# EAGLE design Crazebird-v0.8 (EAGLE 6.6.0)
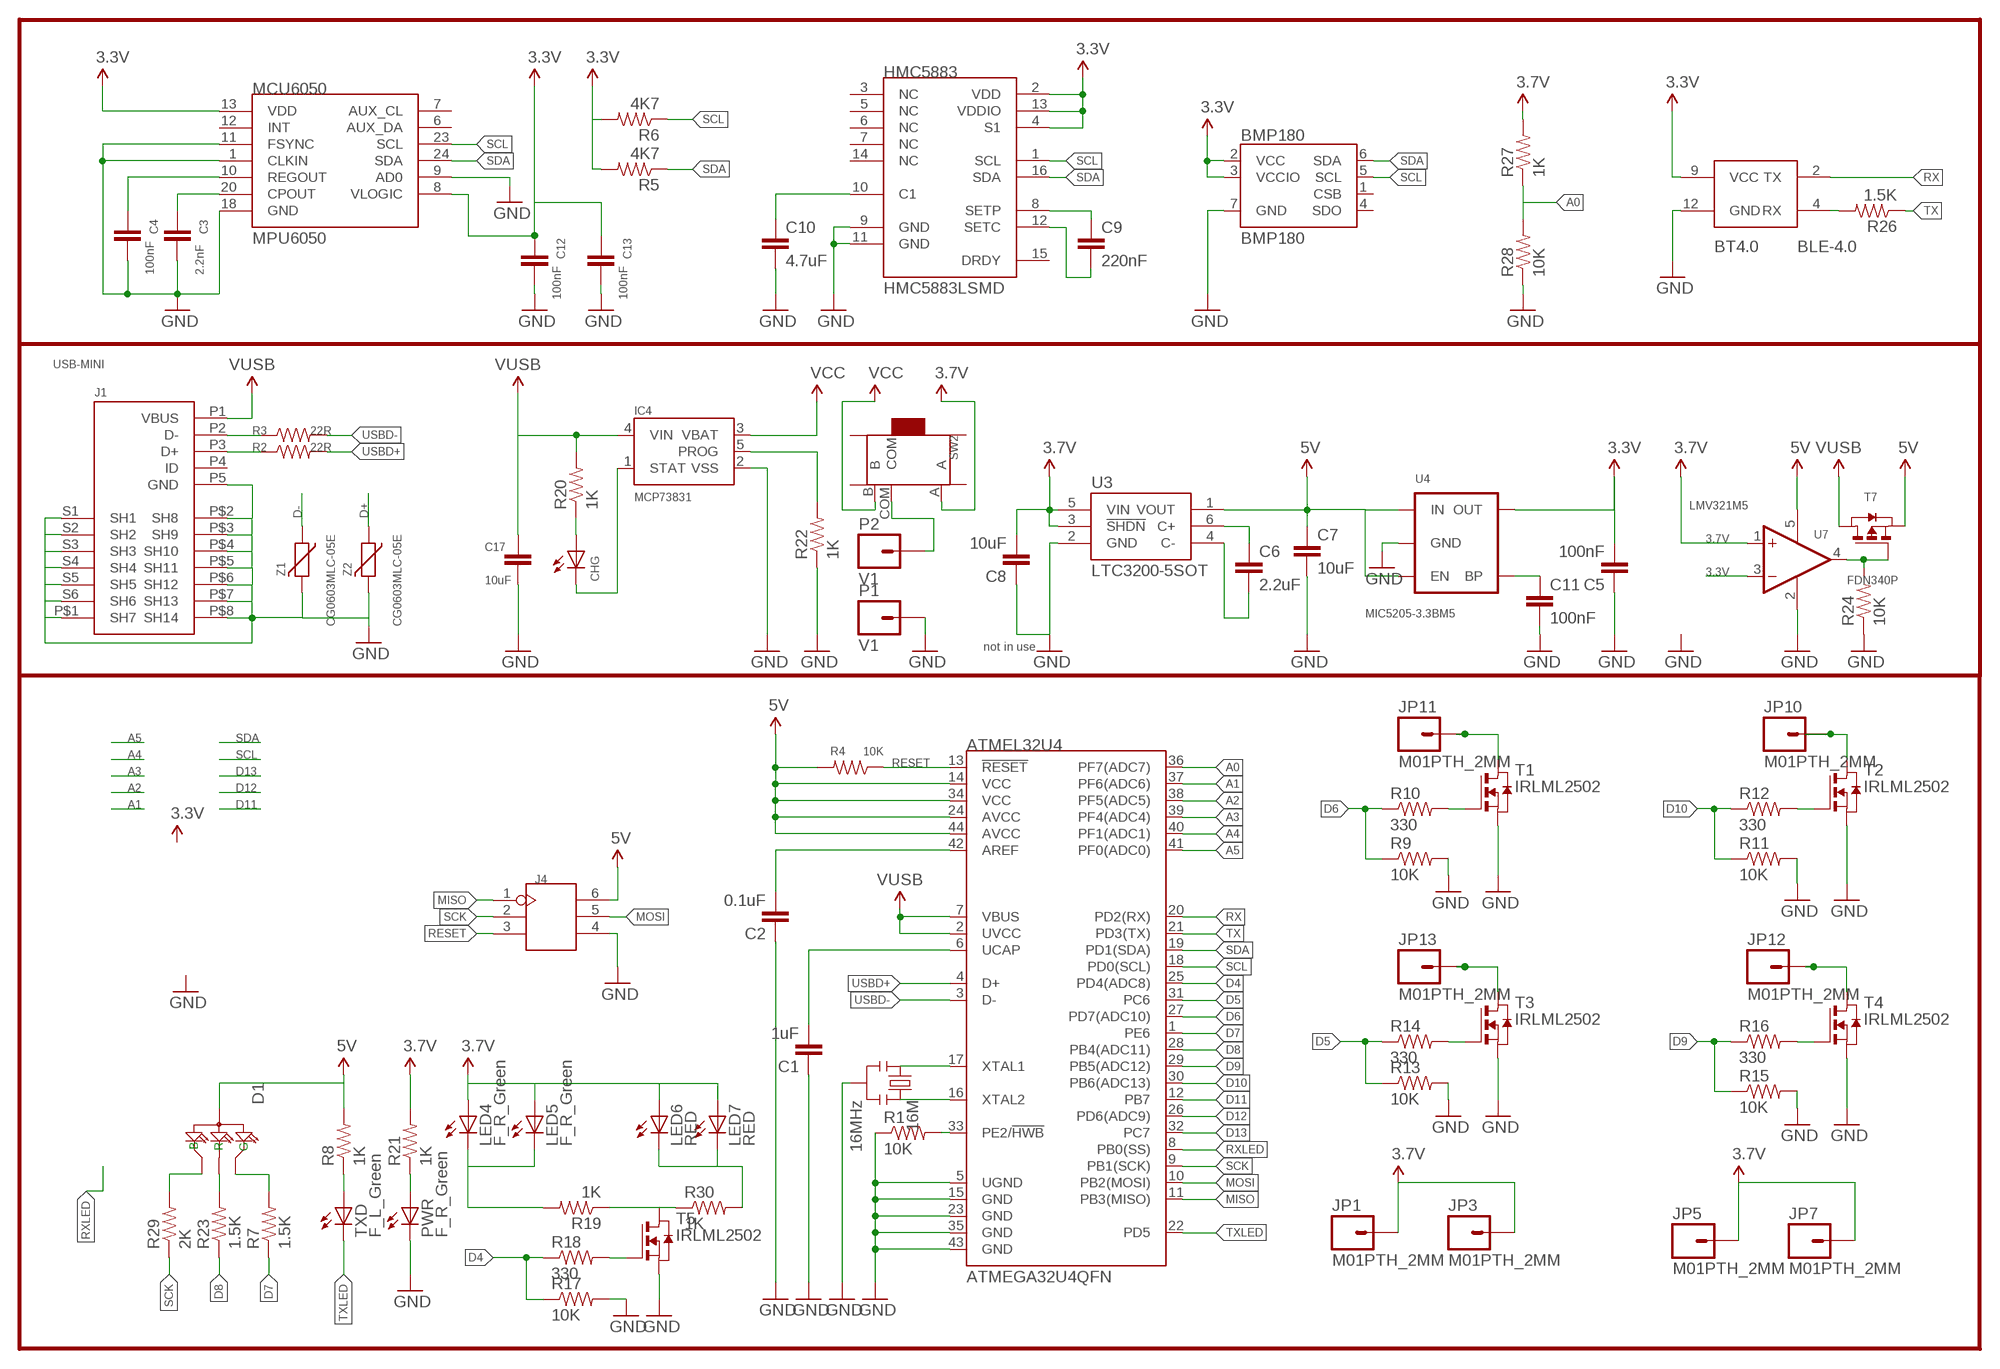
[diagram p0: schematic, sheet 1]

## Parts
16M  16MHz  RESONATOR16MHZ  [RESONATOR-SMD]
ATMEL32U4  ATMEGA32U4QFN  [SPARKFUN-DIGITALIC_QFN-44]
BMP180  BMP180  [BMP180]
BT4.0  BLE-4.0  HEXAIRBOT-HEXNANO_BLUETOOTH_HM11  [HEXAIRBOT-HEXNANO_BLUETOOTH_HM11]
C1  1uF  CAP0402-CAP  [0402-CAP]
C2  0.1uF  CAP0402-CAP  [0402-CAP]
C3  2.2nF  CAP0402-CAP  [0402-CAP]
C4  100nF  CAP0402-CAP  [0402-CAP]
C5  100nF  CAP0402-CAP  [0402-CAP]
C6  2.2uF  CAP0402-CAP  [0402-CAP]
C7  10uF  CAP0402-CAP  [0402-CAP]
C8  10uF  CAP0805  [0805]
C9  220nF  CAP0402-CAP  [0402-CAP]
C10  4.7uF  CAP0402-CAP  [0402-CAP]
C11  100nF  CAP0402-CAP  [0402-CAP]
C12  100nF  CAP0402-CAP  [0402-CAP]
C13  100nF  CAP0402-CAP  [0402-CAP]
C17  10uF  CAP0805  [0805]
CHG  Yellow  LEDCHIPLED_0603  [CHIPLED_0603]
D1  LED-ARGB-4P-1206  [LED-4P-1206-3.0X1.5]
HMC5883  HMC5883LSMD  [16LPCC]
IC4  MCP73831  [SOT23-5]
J1  USB-MINI  [USB_MICRO]
J4  CONNECTOR_HEADER-2X3P-2.0  [CONNECTOR_2X3P-2.0]
JP1  M01PTH_2MM  [1X01_2MM]
JP3  M01PTH_2MM  [1X01_2MM]
JP5  M01PTH_2MM  [1X01_2MM]
JP7  M01PTH_2MM  [1X01_2MM]
JP10  M01PTH_2MM  [1X01_2MM]
JP11  M01PTH_2MM  [1X01_2MM]
JP12  M01PTH_2MM  [1X01_2MM]
JP13  M01PTH_2MM  [1X01_2MM]
LED4  F_R_Green  LEDCHIPLED_0603  [CHIPLED_0603]
LED5  F_R_Green  LEDCHIPLED_0603  [CHIPLED_0603]
LED6  RED  LEDCHIPLED_0603  [CHIPLED_0603]
LED7  RED  LEDCHIPLED_0603  [CHIPLED_0603]
MCU6050  MPU6050  TESTING_MPU-6050-1  [TESTING_QFN-24-4MM2]
P1  V1  M01PTH  [1X01]
P2  V1  M01PTH  [1X01]
PWR  F_R_Green  LEDCHIPLED_0603  [CHIPLED_0603]
R1  10K  RESISTOR0402-RES  [0402-RES]
R2  22R  RESISTOR0402-RES  [0402-RES]
R3  22R  RESISTOR0402-RES  [0402-RES]
R4  10K  RESISTOR0402-RES  [0402-RES]
R5  4K7  RESISTOR0402-RES  [0402-RES]
R6  4K7  RESISTOR0402-RES  [0402-RES]
R7  1.5K  RESISTOR0402-RES  [0402-RES]
R8  1K  RESISTOR0402-RES  [0402-RES]
R9  10K  RESISTOR0402-RES  [0402-RES]
R10  330  RESISTOR0402-RES  [0402-RES]
R11  10K  RESISTOR0402-RES  [0402-RES]
R12  330  RESISTOR0402-RES  [0402-RES]
R13  10K  RESISTOR0402-RES  [0402-RES]
R14  330  RESISTOR0402-RES  [0402-RES]
R15  10K  RESISTOR0402-RES  [0402-RES]
R16  330  RESISTOR0402-RES  [0402-RES]
R17  10K  RESISTOR0402-RES  [0402-RES]
R18  330  RESISTOR0402-RES  [0402-RES]
R19  1K  RESISTOR0402-RES  [0402-RES]
R20  1K  RESISTOR0402-RES  [0402-RES]
R21  1K  RESISTOR0402-RES  [0402-RES]
R22  1K  RESISTOR0402-RES  [0402-RES]
R23  1.5K  RESISTOR0402-RES  [0402-RES]
R24  10K  RESISTOR0402-RES  [0402-RES]
R26  1.5K  RESISTOR0402-RES  [0402-RES]
R27  1K  RESISTOR0402-RES  [0402-RES]
R28  10K  RESISTOR0402-RES  [0402-RES]
R29  2K  RESISTOR0402-RES  [0402-RES]
R30  1K  RESISTOR0402-RES  [0402-RES]
SW2  SWITCH-3P-SMD-6.6X2.8  [3P-SMD-2CH-6.6X2.8-REINFORCE]
T1  IRLML2502  NMOSSOT23  [SOT-23]
T2  IRLML2502  NMOSSOT23  [SOT-23]
T3  IRLML2502  NMOSSOT23  [SOT-23]
T4  IRLML2502  NMOSSOT23  [SOT-23]
T5  IRLML2502  NMOSSOT23  [SOT-23]
T7  FDN340P  [SOT23]
TXD  F_L_Green  LEDCHIPLED_0603  [CHIPLED_0603]
U3  LTC3200-5SOT  [SOT23-6]
U4  MIC5205-3.3BM5  MIC52053.3V  [SOT23-5]
U7  LMV321M5  [SOT23-5]
Z1  CG0603MLC-05E  VARISTORCN0603  [CT/CN0603]
Z2  CG0603MLC-05E  VARISTORCN0603  [CT/CN0603]

## Nets
3.3V: BMP180.2(VCC) BMP180.3(VCCIO) BT4.0.9(VCC) C5.2 C12.1 C13.1 HMC5883.2(VDD) HMC5883.4(S1) HMC5883.13(VDDIO) MCU6050.8(VLOGIC) MCU6050.13(VDD) R5.2 R6.2 U4.5(OUT) U7.3(-IN)
3.7V: C8.2 JP1.1 JP3.1 JP5.1 JP7.1 LED4.A LED5.A LED6.A LED7.A R21.2 R27.2 SW2.A U3.3(!SHDN) U3.5(VIN) U7.1(+IN)
5V: ATMEL32U4.14(VCC) ATMEL32U4.24(AVCC) ATMEL32U4.34(VCC) ATMEL32U4.44(AVCC) C7.1 D1.2(+) J4.6 R4.2 R8.2 T7.2(S) U3.1(VOUT) U4.1(IN) U4.3(EN) U7.5(V+)
A0: ATMEL32U4.36(PF7(ADC7)) R27.1 R28.2
A1: ATMEL32U4.37(PF6(ADC6))
A2: ATMEL32U4.38(PF5(ADC5))
A3: ATMEL32U4.39(PF4(ADC4))
A4: ATMEL32U4.40(PF1(ADC1))
A5: ATMEL32U4.41(PF0(ADC0))
D4: ATMEL32U4.25(PD4(ADC8)) R17.1 R18.1
D5: ATMEL32U4.31(PC6) R13.1 R14.1
D6: ATMEL32U4.27(PD7(ADC10)) R9.1 R10.1
D7: ATMEL32U4.1(PE6) R7.1
D8: ATMEL32U4.28(PB4(ADC11)) R23.1
D9: ATMEL32U4.29(PB5(ADC12)) R15.1 R16.1
D10: ATMEL32U4.30(PB6(ADC13)) R11.1 R12.1
D11: ATMEL32U4.12(PB7)
D12: ATMEL32U4.26(PD6(ADC9))
D13: ATMEL32U4.32(PC7)
D+: J1.P3(D+) R2.1 Z2.1
D-: J1.P2(D-) R3.1 Z1.1
GND [gnd]: 16M.2 ATMEL32U4.5(UGND) ATMEL32U4.15(GND) ATMEL32U4.23(GND) ATMEL32U4.35(GND) ATMEL32U4.43(GND) BMP180.7(GND) BT4.0.12(GND) C1.1 C2.1 C3.2 C4.2 C5.1 C7.2 C8.1 C10.2 C11.2 C12.2 C13.2 C17.1 HMC5883.9(GND) HMC5883.11(GND) IC4.2(VSS) J1.P5(GND) J1.P$1(SH7) J1.P$2(SH8) J1.P$3(SH9) J1.P$4(SH10) J1.P$5(SH11) J1.P$6(SH12) J1.P$7(SH13) J1.P$8(SH14) J1.S1(SH1) J1.S2(SH2) J1.S3(SH3) J1.S4(SH4) J1.S5(SH5) J1.S6(SH6) J4.4 MCU6050.1(CLKIN) MCU6050.9(AD0) MCU6050.11(FSYNC) MCU6050.18(GND) P1.1 PWR.C R1.1 R9.2 R11.2 R13.2 R15.2 R17.2 R22.1 R24.1 R28.1 T1.2(S) T2.2(S) T3.2(S) T4.2(S) T5.2(S) U3.2(GND) U4.2(GND) U7.2(V-) Z1.2 Z2.2
MISO: ATMEL32U4.11(PB3(MISO)) J4.1
MOSI: ATMEL32U4.10(PB2(MOSI)) J4.5
N$1: 16M.1 ATMEL32U4.17(XTAL1)
N$2: 16M.3 ATMEL32U4.16(XTAL2)
N$3: CHG.C IC4.1(STAT)
N$4: CHG.A R20.1
N$5: ATMEL32U4.6(UCAP) C1.2
N$6: ATMEL32U4.42(AREF) C2.2
N$7: R8.1 TXD.A
N$8: C4.1 MCU6050.10(REGOUT)
N$9: C3.1 MCU6050.20(CPOUT)
N$10: D1.1(B) R29.2
N$11: ATMEL32U4.33(PE2/!HWB) R1.2
N$12: R18.2 T5.3(G)
N$13: PWR.A R21.1
N$14: R12.2 T2.3(G)
N$15: R10.2 T1.3(G)
N$16: JP11.1 T1.1(D)
N$17: JP10.1 T2.1(D)
N$18: R14.2 T3.3(G)
N$19: JP13.1 T3.1(D)
N$20: R16.2 T4.3(G)
N$21: JP12.1 T4.1(D)
N$22: R19.1 R30.1 T5.1(D)
N$23: C9.1 HMC5883.8(SETP)
N$24: LED4.C LED5.C R19.2
N$25: C6.1 U3.6(C+)
N$26: IC4.5(PROG) R22.2
N$27: C6.2 U3.4(C-)
N$28: C9.2 HMC5883.12(SETC)
N$29: C10.1 HMC5883.10(C1)
N$30: P2.1 SW2.COM
N$31: C11.1 U4.4(BP)
N$32: D1.4(R) R23.2
N$33: D1.3(G) R7.2
N$34: R24.2 T7.3(G) U7.4(OUT)
N$35: BT4.0.4(RX) R26.2
N$36: LED6.C LED7.C R30.2
RESET: ATMEL32U4.13(!RESET) J4.3 R4.1
RX: ATMEL32U4.20(PD2(RX)) BT4.0.2(TX)
RXLED: ATMEL32U4.8(PB0(SS))
SCK: ATMEL32U4.9(PB1(SCK)) J4.2 R29.1
SCL: ATMEL32U4.18(PD0(SCL)) BMP180.5(SCL) HMC5883.1(SCL) MCU6050.23(SCL) R6.1
SDA: ATMEL32U4.19(PD1(SDA)) BMP180.6(SDA) HMC5883.16(SDA) MCU6050.24(SDA) R5.1
TX: ATMEL32U4.21(PD3(TX)) R26.1
TXLED: ATMEL32U4.22(PD5) TXD.C
USBD+: ATMEL32U4.4(D+) R2.2
USBD-: ATMEL32U4.3(D-) R3.2
VCC: IC4.3(VBAT) SW2.B
VUSB: ATMEL32U4.2(UVCC) ATMEL32U4.7(VBUS) C17.2 IC4.4(VIN) J1.P1(VBUS) R20.2 T7.1(D)
Unconnected: BMP180.1(CSB) BMP180.4(SDO) HMC5883.3(NC) HMC5883.5(NC) HMC5883.6(NC) HMC5883.7(NC) HMC5883.14(NC) HMC5883.15(DRDY) J1.P4(ID) MCU6050.6(AUX_DA) MCU6050.7(AUX_CL) MCU6050.12(INT) SW2.SS1 SW2.SS2 SW2.SS3 SW2.SS4

## Notes on the sheet
- not in use

## Library data of the parts
16M = SparkFun-FreqCtrl:RESONATOR: Resonator Small SMD resonator. Used, eg, on the Arduino Pro/ Pro Mini boards. 8MHz- XTAL-08895 16MHz- XTAL-08900; PROD_ID: XTAL-08900
ATMEL32U4 = SparkFun-DigitalIC:ATMEGA32U4: Atmel 44-pin 8-bit Microcontroller with 32KBytes of ISP Flash and USB Controller ----- Please use the QFN-44-NOPAD_1:1 package for the footprint of all boards using a 32U4. Route traces directly away from the pads as much as possible.
BMP180 = duinofun-ic:BMP180: BMP085 Pressure Sensor Great little MEMS pressure sensor. SKU: COM-09603
BT4.0 = MainBoard:HEXAIRBOT-HEXNANO_BLUETOOTH_HM11: BLE 4.0 Module
C1-C13 = SparkFun-Passives:CAP: Capacitor Standard 0603 ceramic capacitor, and 0.1" leaded capacitor.
C17 = SparkFun:CAP: Capacitor Standard 0603 ceramic capacitor, and 0.1" leaded capacitor.
CHG LED4-LED7 PWR TXD = led:LED: LED OSRAM: - CHIPLED LG R971, LG N971, LY N971, LG Q971, LY Q971, LO R971, LY R971 LH N974, LH R974 LS Q976, LO Q976, LY Q976 LO Q996 - Hyper CHIPLED LW Q18S LB Q993, LB Q99A, LB R99A - SideLED LS A670, LO A670, LY A670, LG A670, LP A670 LB A673, LV A673, LT A673, LW A673 LH A674 LY A675 LS A676, LA A676, LO A676, LY A676, LW A676 LS A679, LY A679, LG A679 - Hyper Micro SIDELED® LS Y876, LA Y876, LO Y876, LY Y876 LT Y87S - SmartLED LW L88C, LW L88S LB L89C, LB L89S, LG L890 LS L89K, LO L89K, LY L89K LS L896, LA L896, LO L896, LY L896 - TOPLED LS T670, LO T670, LY T670, LG T670, LP T670 LSG T670, LSP T670, LSY T670, LOP T670, LYG T670 LG T671, LOG T671, LSG T671 LB T673, LV T673, LT T673, LW T673 LH T674 LS T676, LA T676, LO T676, LY T676, LB T676, LH T676, LSB T676, LW T676 LB T67C, LV T67C, LT T67C, LS T67K, LO T67K, LY T67K, LW E67C LS E67B, LA E67B, LO E67B, LY E67B, LB E67C, LV E67C, LT E67C LW T67C LS T679, LY T679, LG T679 LS T770, LO T770, LY T770, LG T770, LP T770 LB T773, LV T773, LT T773, LW T773 LH T774 LS E675, LA E675, LY E675, LS T675 LS T776, LA T776, LO T776, LY T776, LB T776 LHGB T686 LT T68C, LB T68C - Hyper Mini TOPLED® LB M676 - Mini TOPLED Santana® LG M470 LS M47K, LO M47K, LY M47K Source: http://www.osram.convergy.de LUXEON: - LUMILED® LXK2-PW12-R00, LXK2-PW12-S00, LXK2-PW14-U00, LXK2-PW14-V00 LXK2-PM12-R00, LXK2-PM12-S00, LXK2-PM14-U00 LXK2-PE12-Q00, LXK2-PE12-R00, LXK2-PE12-S00, LXK2-PE14-T00, LXK2-PE14-U00 LXK2-PB12-K00, LXK2-PB12-L00, LXK2-PB12-M00, LXK2-PB14-N00, LXK2-PB14-P00, LXK2-PB14-Q00 LXK2-PR12-L00, LXK2-PR12-M00, LXK2-PR14-Q00, LXK2-PR14-R00 LXK2-PD12-Q00, LXK2-PD12-R00, LXK2-PD12-S00 LXK2-PH12-R00, LXK2-PH12-S00 LXK2-PL12-P00, LXK2-PL12-Q00, LXK2-PL12-R00 Source: www.luxeon.com KINGBRIGHT: KA-3528ASYC Source: www.kingbright.com
D1 = duinofun-main:LED-ARGB*-4P
HMC5883 = HexAirbot-HexNano:HMC5883L: 3 Axis Digital Compass IC
IC4 = SparkFun:MCP73831: Microchip's MCP73831 Miniature single cell, fully integrated Li-Ion, Li-polymer charge management controller http://ww1.microchip.com/downloads/en/DeviceDoc/21984a.pdf
J1 = QXZ:USB-MINI
J4 = duinofun-connector:CONNECTOR_HEADER-2X3P
JP1 JP3 JP5 JP7 JP10-JP13 = duinofun-connector:M01: Header 1 Standard 1-pin 0.1" header. Use with straight break away headers (SKU : PRT-00116), right angle break away headers (PRT-00553), swiss pins (PRT-00743), machine pins (PRT-00117), and female headers (PRT-00115).
MCU6050 = MPU6050:TESTING_MPU-6050
P1 P2 = SparkFun-Connectors:M01: Header 1 Standard 1-pin 0.1" header. Use with straight break away headers (SKU : PRT-00116), right angle break away headers (PRT-00553), swiss pins (PRT-00743), machine pins (PRT-00117), and female headers (PRT-00115).
R1-R24 R26-R30 = SparkFun-Passives:RESISTOR: Resistor Basic schematic elements and footprints for 0603, 1206, and PTH resistors.
SW2 = duinofun-ic:SWITCH-3P-SMD
T1-T5 = zetex:NMOSSOT23: MOS FET; OC_FARNELL: unknown; OC_NEWARK: unknown
T7 = HexAirbot-HexNano:FDN340P: MOS FET
U3 = HexAirbot-HexNano:LTC3200-5: Linear Technology. Low Noise, Regulated Charge Pump DC/DC Converters, SOT23-6. Fixed 5V ± 4% Output or ADJ VIN Range: 2.7V to 4.5V
U4 = SparkFun-PowerIC:MIC5205: MIC5205 150mA vreg 3.3V - VREG-00822 5V - VREG-00823; PROD_ID: VREG-00822
U7 = linear:LMV321?*: General Purpose, Low Voltage, Rail-to-Rail Output Operational Amplifiers Source: http://www.national.com/mpf/LM/LMV321.html http://www.national.com/dt/lmv_qual.pdf
Z1 Z2 = varistor:VARISTOR: VARISTOR

## Net classes
0 default: width 0.254 mm, drill 0.61 mm, clearance 0.254 mm
2 gnd: width 0.254 mm, drill 0.61 mm, clearance 0.254 mm

## Board
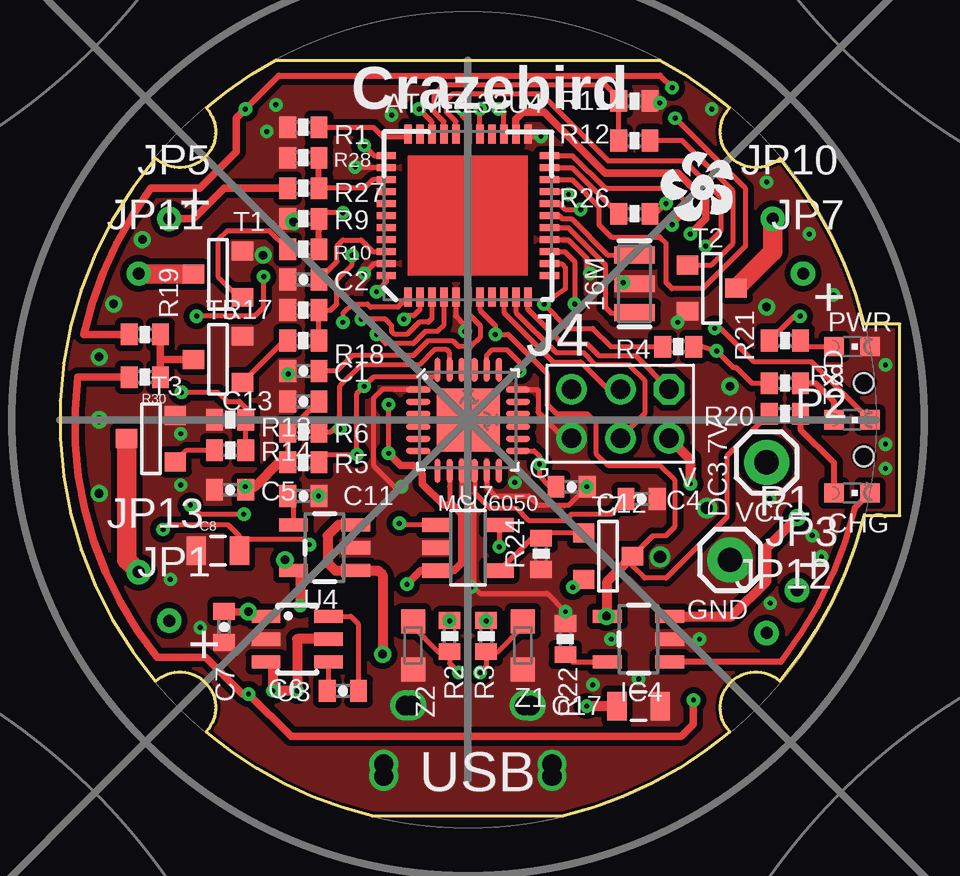
[diagram p1: board, top side]
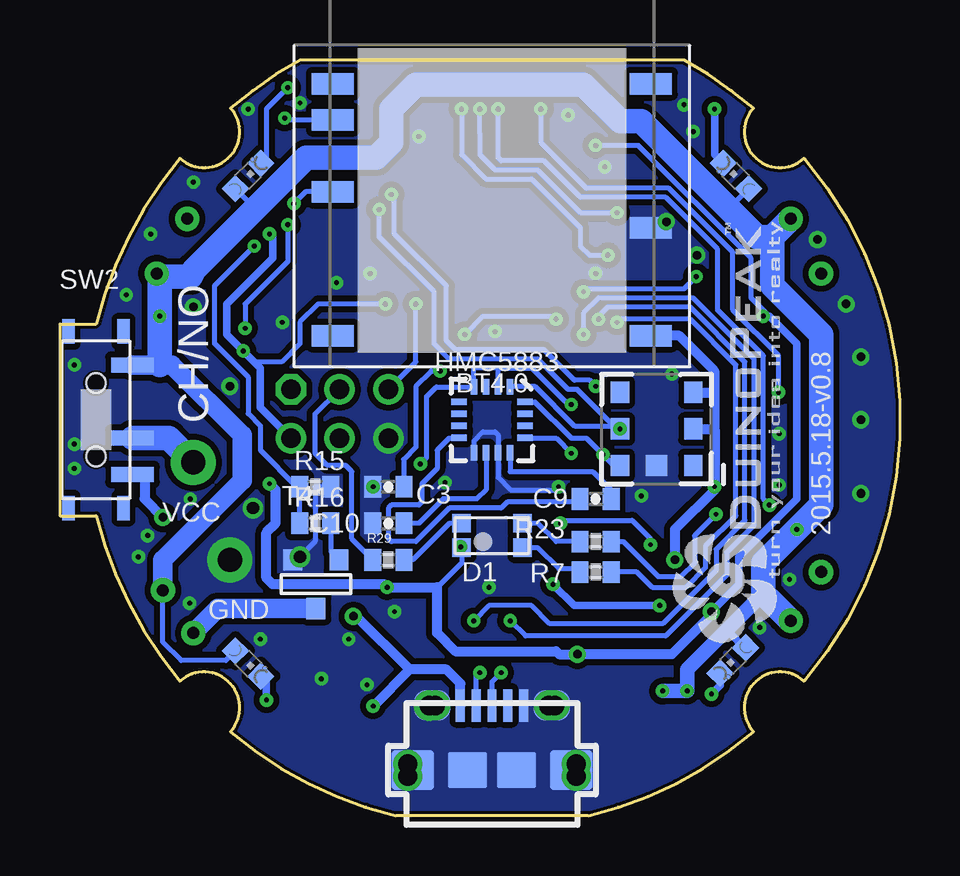
[diagram p2: board, bottom side, seen from below]

Size 35 x 31.5 mm. Coordinates in mm from the lower left corner, seen from the top.
Copper layers (1*16): Top 0.035mm / dielectric 1.5mm / Bottom 0.035mm
Design rules "Sparkfun *": minimum track width 10mil, minimum drill 10mil, track to track 5mil, track to pad 5mil, pad to pad 8mil, via to via 8mil, smd to smd 8mil, copper to edge 5mil, drill to drill 5mil, minimum pad ring 7mil, minimum via ring 7mil, stop-mask expansion 1mil, vias tented up to drill 25mil, thermal gap 2mil

### Footprints (pad centres in the part's own frame; a part is rotated, then mirrored left to right if it is on the bottom)
RESONATOR-SMD = smd 0.7 x 1.7: 1 -1.2,0; 2 0,0; 3 1.2,0
SPARKFUN-DIGITALIC_QFN-44 = smd 0.8 x 0.3: 1 -3.4,2.5; 2 -3.4,2; 3 -3.4,1.5; 4 -3.4,1; 5 -3.4,0.5; 6 -3.4,0; 7 -3.4,-0.5; 8 -3.4,-1; 9 -3.4,-1.5; 10 -3.4,-2; 11 -3.4,-2.5; 23 3.4,-2.5; 24 3.4,-2; 25 3.4,-1.5; 26 3.4,-1; 27 3.4,-0.5; 28 3.4,0; 29 3.4,0.5; 30 3.4,1; 31 3.4,1.5; 32 3.4,2; 33 3.4,2.5 | smd 0.3 x 0.8: 12 -2.5,-3.4; 13 -2,-3.4; 14 -1.5,-3.4; 15 -1,-3.4; 16 -0.5,-3.4; 17 0,-3.4; 18 0.5,-3.4; 19 1,-3.4; 20 1.5,-3.4; 21 2,-3.4; 22 2.5,-3.4; 34 2.5,3.4; 35 2,3.4; 36 1.5,3.4; 37 1,3.4; 38 0.5,3.4; 39 0,3.4; 40 -0.5,3.4; 41 -1,3.4; 42 -1.5,3.4; 43 -2,3.4; 44 -2.5,3.4
BMP180 = smd 0.762 x 0.889: 1 0,0; 2 0,-1.524; 3 0,-3.048; 4 3.048,-3.048; 5 3.048,-1.524; 6 3.048,0 | smd 0.889 x 0.889: 7 1.524,0
HEXAIRBOT-HEXNANO_BLUETOOTH_HM11 = smd 1.75 x 0.9: 1 -6.625,4.859; 2 -6.625,3.359; 4 -6.625,0.359; 8 -6.625,-5.641; 9 6.625,-5.641; 12 6.625,-1.141; 16 6.625,4.859
0402-CAP = smd 0.7 x 0.9: 1 -0.65,0; 2 0.65,0
0805 = smd 0.8 x 1.2: 1 -0.9,0; 2 0.9,0
CHIPLED_0603 = smd 0.8 x 0.8: A 0,-0.75; C 0,0.75
LED-4P-1206-3.0X1.5 = smd 0.762 x 0.762: 1 -1.27,0.508; 2 -1.27,-0.508; 3 1.27,-0.508; 4 1.27,0.508
16LPCC = smd 0.65 x 0.28: 1 -1.37,0.75; 2 -1.37,0.25; 3 -1.37,-0.25; 4 -1.37,-0.75; 9 1.37,-0.75; 10 1.37,-0.25; 11 1.37,0.25; 12 1.37,0.75 | smd 0.28 x 0.65: 5 -0.75,-1.37; 6 -0.25,-1.37; 7 0.25,-1.37; 8 0.75,-1.37; 13 0.75,1.37; 14 0.25,1.37; 15 -0.25,1.37; 16 -0.75,1.37
SOT23-5 = smd 0.55 x 1.2: 1 -0.95,-1.3; 2 0,-1.3; 3 0.95,-1.3; 4 0.95,1.3; 5 -0.95,1.3
USB_MICRO = smd 0.406 x 1.346: P1 -1.321,2.692; P2 -0.66,2.692; P3 0,2.692; P4 0.66,2.692; P5 1.321,2.692 | drill 0.8 pad 1.27: P$1 -2.616,2.692 | drill 0.8 pad 1.245: P$2 -2.362,2.692; P$7 2.362,2.692; P$8 2.616,2.692 | drill 0.8 pad 1.143: P$3 -3.505,-0.254; P$4 -3.505,0.254; P$5 3.505,0.254; P$6 3.505,-0.254 | smd 1.778 x 1.651: S1 -3.302,0; S2 3.302,0 | smd 1.524 x 1.27: S3 -2.489,2.692; S4 2.489,2.692 | smd 1.626 x 1.524: S5 -1.016,0; S6 1.016,0
CONNECTOR_2X3P-2.0 = drill 0.813 pad 1.27 octagon: 1 -1.016,2.032 | drill 0.813 pad 1.27: 2 -1.016,0; 3 -1.016,-2.032; 4 1.016,-2.032; 5 1.016,0; 6 1.016,2.032
1X01_2MM = drill 0.508 pad 1.016: 1 0,0
TESTING_QFN-24-4MM2 = smd 1.016 x 0.254: 1 -2.066,1.257; 2 -2.066,0.75; 3 -2.066,0.247; 4 -2.066,-0.287; 5 -2.066,-0.792; 6 -2.066,-1.297; 13 2.086,-1.297; 14 2.086,-0.792; 15 2.086,-0.287; 16 2.086,0.247; 17 2.086,0.75; 18 2.086,1.257 | smd 0.254 x 1.016: 7 -1.267,-2.122; 8 -0.762,-2.122; 9 -0.258,-2.122; 10 0.278,-2.122; 11 0.78,-2.122; 12 1.287,-2.122; 19 1.287,2.082; 20 0.78,2.082; 21 0.278,2.082; 22 -0.258,2.082; 23 -0.762,2.082; 24 -1.267,2.082 | smd 2.616 x 2.616: P$1 0.02,-0.01
1X01 = drill 1.016 pad 1.88: 1 0,0
0402-RES = smd 0.7 x 0.9: 1 -0.65,0; 2 0.65,0
3P-SMD-2CH-6.6X2.8-REINFORCE = smd 1.778 x 0.635: A 1.524,2.286; B 1.524,-2.286; COM 1.524,-0.762 | smd 0.508 x 1.016: SS1 -1.143,-3.683; SS2 1.143,-3.683; SS3 1.143,3.683; SS4 -1.143,3.683 | hole 0.813: 0,-1.524; 0,1.524
SOT-23 = smd 0.787 x 0.889: 1 0.025,-1.016; 2 -0.94,1.016; 3 0.991,1.016
SOT23 = smd 0.787 x 0.889: 1 0.025,-1.016; 2 -0.94,1.016; 3 0.991,1.016
SOT23-6 = smd 0.55 x 1.2: 1 -0.95,-1.3; 2 0,-1.3; 3 0.95,-1.3; 4 0.95,1.3; 5 0,1.3; 6 -0.95,1.3
SOT23-5' = smd 0.6 x 1.2: 1 -0.95,-1.306; 2 0,-1.306; 3 0.95,-1.306; 4 0.95,1.306; 5 -0.95,1.306
CT/CN0603 = smd 1 x 1: 1 -1,0; 2 1,0

### Placement (x,y rotation side)
16M  23.93,22.17 270 top
ATMEL32U4  17,25.01 90 top
BMP180  8.61,14.6 180 bottom
BT4.0  17,25.64 0 bottom
C1  10.14,18.53 0 top
C2  10.14,22.34 0 top
C3  21.31,13.71 180 bottom
C4  24.23,13.2 0 top
C5  7.09,13.58 0 top
C6  11.79,5.2 180 top
C7  6.84,7.86 270 top
C8  6.58,11.04 0 top
C9  12.68,13.2 0 bottom
C10  21.31,12.18 180 bottom
C11  10.14,13.32 0 top
C12  21.31,13.71 0 top
C13  10.14,17.26 180 top
C17  24.11,4.56 180 top
CHG  33,13.45 270 top
D1  17,11.67 0 bottom
HMC5883  17,16.5 270 bottom
IC4  24.11,7.36 90 top
J1  17,1.89 0 bottom
J4  23.35,16.75 270 top
JP1  4.55,8.12 0 top
JP3  30.71,9.39 0 top
JP5  4.55,24.88 0 top
JP7  30.97,22.6 0 top
JP10  29.7,24.88 0 top
JP11  3.28,22.6 0 top
JP12  29.44,7.61 0 top
JP13  3.28,10.15 0 top
LED4  6.84,26.66 45 bottom
LED5  27.16,26.66 315 bottom
LED6  27.16,6.34 225 bottom
LED7  6.96,6.47 135 bottom
MCU6050  17,16.5 0 top
P1  27.92,10.66 0 top
P2  29.44,14.72 0 top
PWR  33,19.55 270 top
R1  10.14,28.69 0 top
R2  16.23,7.48 90 top
R3  17.76,7.48 90 top
R4  25.76,19.55 0 top
R5  10.14,14.72 180 top
R6  10.14,15.99 180 top
R7  12.68,10.15 180 bottom
R8  30.2,18.02 180 top
R9  10.14,24.88 180 top
R10  10.14,23.61 180 top
R11  23.93,29.79 0 top
R12  23.93,28.14 0 top
R13  7.09,16.5 180 top
R14  7.09,15.23 180 top
R15  24.36,13.71 0 bottom
R16  24.36,12.18 0 bottom
R17  10.14,21.07 180 top
R18  10.14,19.8 180 top
R19  3.53,20.06 180 top
R20  30.2,16.75 180 top
R21  30.2,19.8 180 top
R22  21.06,7.36 270 top
R23  12.68,11.42 180 bottom
R24  20.04,10.91 90 top
R26  23.93,25.09 0 top
R27  10.14,26.15 180 top
R28  10.14,27.42 0 top
R29  21.31,10.66 0 bottom
R30  3.53,18.28 180 top
SW2  33.5,16.5 0 bottom
T1  6.58,22.6 270 top
T2  27.16,21.96 90 top
T3  3.79,15.74 270 top
T4  24.36,9.64 0 bottom
T5  6.58,19.04 270 top
T7  22.84,10.79 90 top
TXD  33,16.5 270 top
U3  9.88,7.36 270 top
U4  11.03,11.17 90 top
U7  LMV321M5  [SOT23-5']  17,11.17 270 top
U$1  [XFK-MINI-O4B]  17,16.5 0 top
U$2  [DUINOFUN-LOGO-PCB-0.4]  25,24.76 0 top
U$4  [DUINOPEAK-LOGO-0.6]  4.87,7.17 90 bottom
Z1  19.28,7.1 270 top
Z2  14.71,7.1 270 top

### Tracks (layer width: path | path; a pad name or v marks a point on that pad's centre or on a via)
3.3V  (via drill 0.2, 0.36)  (1 unrouted)
  Top 0.203: C13.1 10.76,17.26 R6.2 R5.2 | MCU6050.8 16.23,13.71 | MCU6050.8 | MCU6050.8 16.23,12.94 | v13.69,15.1 v13.69,17.14 | 15.03,10.22 U7.3 | C12.1 20.42,13.71 19.98,14.15 v19.98,14.66 19.98,14.98 19.76,15.2 MCU6050.13
  Top 0.305: 15.03,10.22 v14.46,9.64 | U7.3 16.43,10.22 16.74,10.53 16.74,12.56 16.36,12.94 16.23,12.94 15.98,12.94 15.09,13.83 15.09,14.21 14.71,14.6 14.2,14.6 v13.69,15.1
  Top 0.406: 9.5,14.71 R5.2 9.12,14.72 8.11,13.71 v7.72,13.71 | v9.38,10.66 9.38,10.22 U4.5 10.01,10.22 v10.01,8.75
  Bottom 0.203: 16.75,18.66 16.74,18.66 | HMC5883.2 16.74,18.66 | 16.74,18.66 15.34,18.66 13.82,17.14 v13.69,17.14 | HMC5883.13 15.61,15.74 14.33,15.74 v13.69,15.1 | 16.74,18.66 17.76,18.66 17.76,17.88 HMC5883.4 19.31,17.87 19.73,17.45 19.73,14.91 v19.98,14.66
  Bottom 0.305: v14.46,9.64 13.57,8.75 v10.01,8.75
  Bottom 0.406: BT4.0.9 9.2,20 7.74,18.55 7.74,17.64 | 7.74,17.64 7.74,16.12 | BMP180.3 7.74,17.64 | BMP180.2 7.74,16.12 | 7.74,16.12 7.72,16.1 v7.72,13.71 7.72,13.58 9.38,11.93 v9.38,10.66
3.7V  (via drill 0.2)
  Top 0.203: 4.56,8.12 JP1.1 | 7.48,11.52 10.16,11.52 v10.39,11.29 | R21.2 29.57,19.8 30.58,20.82 v30.84,20.82 | C8.2 7.48,11.52 | 7.48,11.52 7.48,11.64 7.01,12.11 4.47,12.11 v4.3,11.93 | U7.1 14.2,12.12 v14.14,12.18
  Top 0.305: R27.2 6.84,26.15 5.57,24.88 JP5.1
  Top 0.406: U3.3 8.87,6.41 v8.87,5.2 v9.88,5.2 9.88,7.36 U3.5
  Bottom 0: SW2.A
  Bottom 0.203: 5.76,9.32 5.69,9.26 5.44,9.01 | 5.82,9.39 5.76,9.32 | 5.76,9.32 5.76,9.2 | LED6.A 28.09,6.47 29.95,6.47 30.71,7.23 JP3.1 | v14.14,12.18 14.01,12.31 11.15,12.31 10.39,11.55 v10.39,11.29 | 30.84,20.31 30.84,20.06 | LED5.A 27.07,25.52 26.65,25.52 | LED4.A 7.11,25.33 7.15,25.33
  Bottom 0.254: 4.93,24.76 4.93,24.5
  Bottom 0.305: 5.06,8.12 JP1.1 | LED7.A 6.35,6.87 7.22,7.74
  Bottom 0.61: 5.31,8.88 5.44,9.01 | v9.88,5.2 v8.87,5.2 8.87,6.09 7.22,7.74 5.76,9.2 5.69,9.26
  Bottom 0.813: JP3.1 30.71,10.66 27.41,13.96 27.41,15.87 30.33,18.79 30.84,18.79 SW2.A
  Bottom 1.016: JP5.1 4.93,24.5 5.31,24.12 | 5.31,24.12 5.95,24.12 7.15,25.33 10.77,28.95 11.66,28.95 13.19,30.47 20.17,30.47 21.19,29.45 21.19,28.06 21.82,27.42 24.74,27.42 26.65,25.52 29.43,22.74 29.55,22.47 30.84,22.47 | 5.44,9.01 JP1.1 | 5.31,24.12 5.31,22.09 3.28,20.06 3.28,12.94 v4.3,11.93 5.69,10.53 5.69,9.26 | JP7.1 30.84,22.47 | 30.84,22.47 v30.84,20.82 30.84,20.06 30.84,18.79
5V  (via drill 0.2, 0.36)
  Top 0.203: 18.39,12.18 18.33,12.18 U7.5 v18.3,11.2 | ATMEL32U4.44 13.6,22.24 v13.19,21.83 | ATMEL32U4.14 21.04,23.51 21.44,23.1 v21.44,21.33 | R4.2 26.77,19.55 v27.36,19.37 28.04,18.68 28.17,18.68 28.83,18.02 R8.2 29.19,18.02 | v5.69,20.82 8.11,20.82 8.49,21.2 v8.49,22.47 | v12.68,27.93 13.1,27.51 ATMEL32U4.34
  Top 0.305: ATMEL32U4.24 19,29.04 19.28,29.33 20.17,29.33 22.71,26.79 25.76,26.79 26.9,25.64 26.9,24.88 v26.27,24.25 | C7.1 6.85,8.5 v7.85,8.5
  Top 0.406: U3.1 8.04,8.31 v7.85,8.5 | T7.2 21.49,9.52 v21.36,9.52 | J4.6 26.27,14.85 v26.27,13.83 | U4.3 11.6,12.12 11.15,11.67 11.15,10.53 11.47,10.22 U4.1 13.25,10.22 13.44,10.02 v13.44,6.72
  Bottom 0.203: v13.19,21.83 13.06,21.96 8.99,21.96 v8.49,22.47 | v12.68,27.93 10.9,27.93 6.2,23.23 6.2,21.58 5.44,20.82 v5.69,20.82 | v27.36,19.37 26.9,18.91 25.76,18.91 25,19.68 25,20.56 24.23,21.33 v21.44,21.33 | 19.28,9.52 18.27,10.53 D1.2 v18.3,11.2
  Bottom 0.305: J4.6 26.65,17.01 26.65,18.66 v27.36,19.37 28.04,20.06 28.04,21.33 26.14,23.23 26.14,24.12 v26.27,24.25 | 5.44,20.82 4.3,19.68 4.3,13.2 6.71,10.79 6.71,9.64 v7.85,8.5
  Bottom 0.406: v7.85,8.5 7.85,8.37 9.5,6.72 v13.44,6.72 14.2,6.72 14.33,6.85 18.52,6.85 19.28,7.61 19.28,9.52 v21.36,9.52 21.49,9.64 26.14,9.64 26.39,9.9 26.39,11.8 26.01,12.18 26.01,13.58 v26.27,13.83
A0
  Top 0.203: 10.79,26.51 R27.1 12.68,26.15 13.03,26.51 ATMEL32U4.36
  Top 0.254: R27.1 R28.2
D4  (via drill 0.2)
  Top 0.203: R18.1 R17.1 11.28,21.07 11.53,21.33 11.53,22.34 12.17,22.98 v12.17,23.36 | ATMEL32U4.25 18.5,29.22 v18.27,29.45
  Bottom 0.203: v18.27,29.45 18.27,27.55 17.25,26.53 15.34,26.53 13.31,24.5 13.31,23.74 12.93,23.36 v12.17,23.36
D5  (via drill 0.2)
  Top 0.203: R14.1 R13.1 7.74,16.99 7.47,17.26 6.96,17.26 6.58,17.64 v5.06,17.64 | ATMEL32U4.31 15.5,28.92 v14.96,29.45
  Bottom 0.203: v14.96,29.45 14.96,28.06 13.06,26.15 9.63,26.15 6.96,23.48 6.96,21.07 5.06,19.17 v5.06,17.64
D6  (via drill 0.2)
  Top 0.203: ATMEL32U4.27 v17.5,29.45 | 10.79,24.37 10.79,24.5 10.79,25.14 v11.79,25.14
  Top 0.254: R10.1 10.79,24.12 10.79,24.37 R9.1
  Bottom 0.203: v17.5,29.45 ATMEL32U4.27 17.5,27.54 16.87,26.91 15.09,26.91 13.31,25.14 v11.79,25.14
D7  (via drill 0.2)
  Top 0.203: ATMEL32U4.1 14.07,21.19 12.94,21.19 12.8,21.33 12.17,21.33 11.79,20.95 v11.79,20.56
  Bottom 0.203: v11.79,20.56 11.66,20.69 8.74,20.69 6.84,18.79 6.84,12.5 8.11,11.23 8.11,10.34 8.93,9.52 10.33,9.52 10.96,10.15 R7.1
D8  (via drill 0.2)
  Top 0.203: v16.74,29.45 16.74,29.2 17,28.95 ATMEL32U4.28 | v5.44,12.94 5.82,12.56 v7.66,12.56
  Bottom 0.203: v16.74,29.45 16.74,27.42 16.61,27.3 14.84,27.3 13.31,25.77 9.76,25.77 7.6,23.61 7.6,21.07 5.69,19.17 5.69,13.2 v5.44,12.94 | v7.66,12.56 8.55,11.67 8.55,10.53 9.12,9.96 10.07,9.96 11.53,11.42 R23.1
D9  (via drill 0.2)
  Top 0.203: ATMEL32U4.29 16.5,28.94 16.11,29.33 16.11,29.84 16.36,30.09 20.04,30.09 22.84,27.3 26.01,27.3 27.54,25.77 27.54,24.37 v26.9,23.74
  Bottom 0.203: R16.1 R15.1 25.12,13.71 26.65,15.23 26.65,16.25 27.16,16.75 27.16,18.28 28.55,19.68 28.55,22.09 v26.9,23.74
D10
  Top 0.203: R12.1 R11.1 23.28,29.9 22.71,30.47 15.98,30.47 15.6,30.09 15.6,29.33 16,28.93 ATMEL32U4.30
D+  (via drill 0.2)
  Top 0.203: Z2.1 14.71,7.86 15.74,6.83 R2.1 16.23,6.34 v16.61,5.96
  Bottom 0.203: J1.P3 17,5.58 v16.61,5.96
D-  (via drill 0.2)
  Top 0.203: Z1.1 19.28,7.86 18.25,6.83 R3.1 17.76,6.21 v17.5,5.96
  Bottom 0.203: J1.P2 17.66,5.81 v17.5,5.96
GND  (via drill 0.2, 0.36, 0.51)
  Top 0.203: ATMEL32U4.5 16.49,21.47 16.49,20.82 16.87,20.44 v16.87,20.18 | MCU6050.1 13.44,17.77 13.06,17.39 13.06,14.6 13.95,13.71 v14.23,13.71 | ATMEL32U4.43 13.09,23.01 v12.68,22.6 | ATMEL32U4.15 21.17,24.01 21.95,23.23 21.95,22.6 22.08,22.47 | MCU6050.18 19.92,17.76 19.92,16.8 20.98,15.74 J4.4 | MCU6050.9 16.74,13.33 17.25,12.82 17.25,9.52 17.5,9.26 20.3,9.26 v21.06,8.5 | MCU6050.11 17.78,13.69 18.14,13.32 19.54,13.32 19.92,12.94 21.19,12.94 | 21.2,12.94 C12.2 | ATMEL32U4.23 19.59,28.31 v20.04,28.31 | ATMEL32U4.35 12.33,27.01 v12.3,27.04
  Bottom 0.203: HMC5883.9 17.75,15.62 17.38,15.99 16.87,15.99 16.75,15.87 HMC5883.11 16.75,14.09 16.23,13.58 14.35,13.58 v14.23,13.71 | R15.2 24.36,13.71 24.36,11.42 v25,10.79
  other vias: 1.63,16.5 26.65,7.36 31.73,10.79 34.39,18.79 32.24,21.71 25.73,20.56 10.77,13.32 9.5,18.41 9.73,24.76 8.61,28.51 13.82,29.2 22.96,7.36 23.47,22.21 21.95,13.71 8.46,23.36 2.24,21.33 3.43,24.02 8.99,29.63 1.63,13.43 1.63,19.12 5.03,15.92 5.03,13.78 24.11,5.71 22.2,5.45 29.44,26.41 26.95,12.82 27.92,17.9 29.44,21.2 5.85,7.84 4.6,9.85 34.39,14.47 34.39,15.48 31.35,11.67 29.57,13.2 29.59,8.85 31.22,24.25 27.16,29.45 22.08,22.6 25,29.71 17.12,9.52 18.95,13.88
  pour Top (no thermals): -0.28,31.74 35.28,31.74 35.28,-0.26 -0.28,-0.26
  pour Bottom (no thermals): -0.28,31.74 35.28,31.74 35.28,-0.26 -0.28,-0.26
MISO
  Top 0.203: J4.1 23.98,19.17 22.46,19.17 21.95,19.68 20.93,19.68 19.5,21.11 ATMEL32U4.11
MOSI
  Top 0.203: ATMEL32U4.10 19,20.98 20.68,19.29 21.82,19.29 22.33,18.79 23.73,18.79 24.36,18.15 24.36,16.75 J4.5
N$1
  Top 0.203: ATMEL32U4.17 20.81,25.01 20.93,24.88 21.31,24.88 22.83,23.37 16M.1
N$2
  Top 0.203: ATMEL32U4.16 21.18,24.51 22.71,22.98 22.71,21.2 22.96,20.95 23.91,20.95 16M.3
N$3
  Top 0.254: CHG.C 33.11,12.82 arc-24 30.08,6.47 30.02,6.41 IC4.1
N$4
  Top 0.254: R20.1 30.85,16.1 32.25,14.71 CHG.A
N$5
  Top 0.203: C1.2 11.53,18.53 12.17,19.17 14.71,19.17 15.34,19.8 16.36,19.8 16.61,19.55 17.12,19.55 17.5,19.93 17.5,20.44 17,20.95 ATMEL32U4.6
N$6
  Top 0.203: C2.2 11.41,22.98 11.53,23.1 11.53,23.74 11.79,23.99 12.55,23.99 13.03,23.51 ATMEL32U4.42
N$7
  Top 0.254: TXD.A 32.25,17.25 31.47,18.02 R8.1
N$8
  Top 0.203: MCU6050.10 17.27,13.44 17.9,12.82 19,12.82 19.51,12.31 21.06,12.31 21.31,12.56 22.96,12.56 23.58,13.18 C4.1
N$9  (via drill 0.2)
  Top 0.203: MCU6050.20 17.78,19.18 18.01,19.42 18.62,19.42 19.15,18.89 v19.15,18.53
  Bottom 0.203: v19.15,18.53 19.54,18.53 20.17,17.9 20.17,15.36 20.68,14.85 20.68,13.72 C3.1
N$10
  Bottom 0.203: D1.1 18.77,12.18 20.3,10.66 R29.2
N$11
  Top 0.203: R1.2 13.06,28.69 13.44,28.31 14.4,28.31 ATMEL32U4.33
N$12
  Top 0.203: T5.3 9.35,19.8 R18.2
N$13
  Top 0.203: R21.1 31.11,19.55 PWR.A
N$14
  Top 0.203: R12.2 25.93,28.14 28.04,26.02 28.04,23.87 27.13,22.95 T2.3
N$15
  Top 0.203: R10.2 8.73,24.37 6.96,24.37 6.58,23.99 6.58,22.47 7.45,21.61 T1.3
N$16
  Top 0.813: T1.1 3.3,22.57 JP11.1
N$17
  Top 0.813: JP10.1 29.7,23.51 T2.1
N$18
  Top 0.203: T3.3 5.29,15.23 R14.2
N$19
  Top 0.813: T3.1 2.77,10.66 JP13.1
N$20
  Bottom 0.203: R16.2 23.71,11 T4.3
N$21
  Bottom 0.813: T4.1 28.43,8.63 JP12.1
N$22
  Top 0.305: R19.1 4.18,19.02 | T5.1 5.06,19.02 4.18,19.02 | R30.1 4.18,19.02
N$23
  Bottom 0.203: HMC5883.8 18.39,15.72 18.79,15.72 19.28,15.23 19.28,14.47 19.92,13.83 19.92,13.07 20.04,12.94 21.19,12.94 21.31,12.82 21.31,11.55 21.19,11.42 20.17,11.42 18.77,12.82 16.61,12.82 16.36,13.07 13.33,13.07 C9.1
N$24  (via drill 0.2)
  Top 0.254: v25.5,30.34 25,30.85 9.12,30.85 v7.72,29.45
  Top 0.305: v7.72,29.45 7.34,29.07 7.34,27.68 5.82,26.15 3.79,26.15 arc24 0.99,20.06 R19.2
  Bottom 0.203: v25.5,30.34 26.39,29.45 26.39,27.42 LED5.C
  Bottom 0.305: LED4.C 7.72,27.55 v7.72,29.45
N$25
  Top 0.203: U3.6 12.11,8.31 12.42,7.99 12.42,5.21 C6.1
N$26
  Top 0.203: R22.2 21.36,6.41 IC4.5
N$27
  Top 0.203: U3.4 11.18,5.24 C6.2
N$28
  Bottom 0.203: HMC5883.12 16.25,14.34 12.8,14.34 12.03,13.56 C9.2 12.04,13.47
N$29
  Bottom 0.203: HMC5883.10 17.25,13.58 17.63,13.2 19.03,13.2 20.04,12.18 C10.1 | 20.66,12.32 C10.1 | 20.3,12.18 C10.1
N$30
  Bottom 1.016: SW2.COM 30.46,15.74 P2.1
N$31
  Top 0.203: C11.1 9.73,13.09 U4.4
N$32
  Bottom 0.203: R23.2 14.33,11.42 15.09,12.18 D1.4
N$33
  Bottom 0.203: R7.2 13.45,10.28 14.2,10.28 15.09,11.17 D1.3
N$34
  Top 0.203: U7.4 19.65,11.56 R24.2 20.04,11.78 T7.3
N$35  (via drill 0.2)
  Top 0.203: v25.25,25.52 24.82,25.09 R26.2
  Bottom 0.203: BT4.0.4 24.76,26 v25.25,25.52
N$36  (via drill 0.2)
  Top 0.305: R30.2 0.74,18.28 arc46 4.04,6.59 6.07,6.59 7.6,5.07 v7.85,5.07 9.63,3.29 25.89,3.29 26.39,3.8 v26.39,4.82
  Bottom 0.305: v26.39,4.82 26.39,5.81 LED6.C | LED7.C 7.49,5.43 v7.85,5.07
RESET  (via drill 0.2)
  Top 0.203: ATMEL32U4.13 20.9,23.01 21.06,22.85 21.06,21.96 v20.17,21.33 21.19,20.31 22.2,20.31 22.96,19.55 R4.1
  Bottom 0.203: J4.3 20.17,18.91 v20.17,21.33
RX  (via drill 0.2)
  Top 0.203: ATMEL32U4.20 21.34,26.51 22.46,25.39 22.46,24.63 22.96,24.12 25,24.12 25.25,23.87 25.25,22.21 25.5,21.96 26.77,21.96 28.55,23.74 28.55,26.15 v25.63,29.07
  Bottom 0.203: v25.63,29.07 25.56,29 BT4.0.2
SCK
  Top 0.203: J4.2 22.84,17.77 21.69,18.91 20.55,18.91 18.5,20.97 ATMEL32U4.9
  Bottom 0.203: 21.95,10.64 R29.1 22.84,11.53 22.84,14.34 23.09,14.6 23.85,14.6 24.36,15.1 24.36,16.75 J4.2
SCL  (via drill 0.2)
  Top 0.203: R6.1 11.28,15.99 11.66,16.37 | 11.66,16.37 11.66,17.9 12.55,18.79 14.96,18.79 15.6,19.42 16.11,19.42 16.23,19.29 | ATMEL32U4.18 20.81,25.52 21.06,25.26 v21.69,25.26 | MCU6050.23 16.23,19.29 | 16.23,19.29 | 11.66,16.37 BMP180.5
  Bottom 0.203: HMC5883.1 16.25,17.9 15.22,17.9 13.57,16.25 11.79,16.25 BMP180.5 11.79,16.12 13.44,17.77 13.82,17.77 15.09,19.04 18.77,19.04 19.41,19.68 19.41,21.83 21.69,24.12 v21.69,25.26
  other vias: 11.66,16.12
SDA  (via drill 0.2)
  Top 0.203: MCU6050.24 15.73,18.28 13.06,18.28 v12.68,17.9 12.37,17.59 v12.37,15.05 11.12,15.05 R5.1 | ATMEL32U4.19 21.08,26.01 v21.19,25.9
  Bottom 0.203: HMC5883.16 15.21,17.25 13.69,15.74 13.06,15.74 v12.37,15.05 11.92,14.6 BMP180.6 | v21.19,25.9 21.06,25.77 21.06,24.25 18.9,22.09 18.9,19.8 18.52,19.42 14.84,19.42 13.57,18.15 12.93,18.15 v12.68,17.9
TX
  Top 0.203: ATMEL32U4.21 21.35,27.01 23.16,25.2 R26.1
TXLED  (via drill 0.2)
  Top 0.203: TXD.C 31.33,18.91 28.93,18.91 27.54,20.31 v27.28,20.31 | ATMEL32U4.22 21.35,27.51 22.71,26.15 25.5,26.15 26.01,25.64 26.01,25.14 v25.5,24.63
  Bottom 0.203: v25.5,24.63 25.5,23.1 27.28,21.33 v27.28,20.31
USBD+  (via drill 0.2)
  Top 0.203: R2.2 v16.23,8.12 | ATMEL32U4.4 15.98,21.47 15.98,20.44 15.73,20.18 15.22,20.18 14.71,19.68 13.57,19.68 v13.19,20.06
  Bottom 0.203: v13.19,20.06 13.19,20.95 12.55,21.58 8.61,21.58 6.07,19.04 6.07,12.12 7.22,10.98 7.22,10.02 9.76,7.48 15.6,7.48 v16.23,8.12
USBD-  (via drill 0.2)
  Top 0.203: R3.2 v17.76,8.12 | ATMEL32U4.3 15.5,20.71 15.34,20.56 14.96,20.56 14.46,20.06 13.95,20.06 13.82,20.18 13.82,20.44 13.57,20.69 v12.55,20.69
  Bottom 0.203: v12.55,20.69 12.55,20.82 12.17,21.2 8.74,21.2 6.45,18.91 6.45,12.31 7.66,11.1 7.66,10.21 9.88,7.99 14.58,7.99 15.34,8.75 17.12,8.75 v17.76,8.12
VCC  (via drill 0.36)
  Top 0.406: IC4.3 27.98,8.31 29.44,9.77 29.44,11.17 v30.71,12.44
  Bottom 0.406: SW2.B 31.47,14.21 31.47,13.2 v30.71,12.44
VUSB  (via drill 0.2, 0.36)
  Top 0.203: ATMEL32U4.7 17.5,21.08 18.14,20.44 v18.14,20.06 18.67,20.06 20.3,18.43 20.3,17.14 20.68,16.75 21.95,16.75 22.33,16.37 22.33,15.1 22.84,14.6 25,14.6 25.63,13.96 25.63,12.05 25.25,11.67 24.72,11.67 T7.1 23.85,10.4 24.36,9.9 25.25,9.9 27.79,12.44 27.79,14.99 R20.2 | ATMEL32U4.2 15,21.1 14.73,20.84 14.48,20.84 v14.33,20.69
  Top 0.406: C17.2 v21.95,4.56 | v22.77,8.31 IC4.4 22.81,9.76 T7.1
  Bottom 0.203: v18.14,20.06 17.38,20.82 14.46,20.82 v14.33,20.69
  Bottom 0.406: J1.P1 18.32,5.5 18.9,6.09 20.42,6.09 | 20.42,6.09 v21.95,4.56 | 20.42,6.09 22.64,8.31 v22.77,8.31

### Text on the board
tPlace: Crazebird | + | + | G | V | VCC | DC3.7V | GND | + | + | USB
bPlace: CH/NO | VCC | 2015.5.18-v0.8 | GND